# Altium schematic sheet Input_Stage.SchDoc
size A4; SheetNumber: 2; SheetTotal: 6
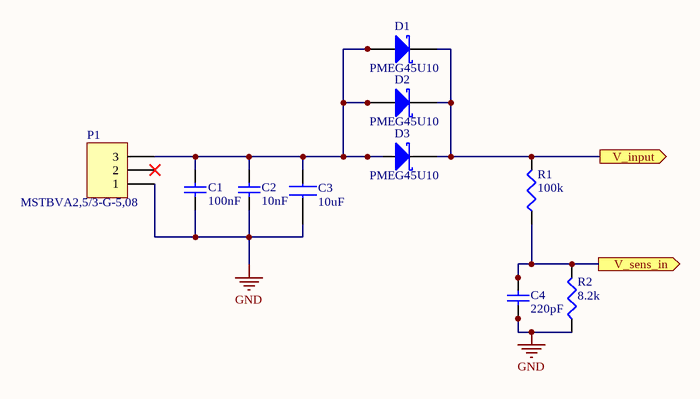
[diagram p0: Input_Stage.SchDoc]

## Parts
C1  value 100nF  [CAPC3216X180N]  (hidden comment: 10nF)
C2  value 10nF  [CAPC3216X180N]  (hidden comment: 100µF)
C3  value 10uF  [CAPC3225X270N]  (hidden comment: GRM32EC72A106KE05K)
C4  220pF  [CAPC3216X180N]
D1  PMEG45U10  [PMEG45U10EPDZ]
D2  PMEG45U10  [PMEG45U10EPDZ]
D3  PMEG45U10  [PMEG45U10EPDZ]
P1  MSTBVA2,5/3-G-5,08  [HDR1X3]
R1  value 100k  [RESC3216X75N]  (hidden comment: 100KΩ)
R2  value 8.2k  [RESC3216X75N]  (hidden comment: 8.2KΩ)

## Ports
V_input (out), V_sens_in (out)

## Nets
GND: C1.1 C2.1 C3.1 C4.1 P1.1 R2.1
V_input: D1.3 D2.3 D3.3 R1.2 ; port V_input
V_sens_in: C4.2 R1.1 R2.2 ; port V_sens_in
NetC1_2: C1.2 C2.2 C3.2 D1.1 D1.2 D2.1 D2.2 D3.1 D3.2 P1.3

Not connected (* = marked no-connect by the designer): P1 2*

## Library data of the parts
C1 = CC1206KKX7R0BB104: Capacitor 100nF; Published: 8-Jun-2000; LatestRevisionDate: 17-Jul-2002; LatestRevisionNote: Re-released for DXP Platform.; PackageReference: RAD-0.3; Publisher: Altium Limited; PackageDescription: Radial Cap, Thru-Hole; 2 Leads; 0.3 in Pin Spacing; Supplier 1: Farnell
C2 = C1206C103K1RACTU: Capacitor 10nF; Published: 8-Jun-2000; LatestRevisionDate: 17-Jul-2002; LatestRevisionNote: Re-released for DXP Platform.; PackageReference: RAD-0.3; Publisher: Altium Limited; PackageDescription: Radial Cap, Thru-Hole; 2 Leads; 0.3 in Pin Spacing; Supplier 1: Mouser
C3 = GRM32EC72A106KE05K: Ceramic capacitor 10uF; Manufacturer_Name: Murata Electronics; Height: 2.7mm; Manufacturer_Part_Number: GRM32EC72A106KE05K; Mouser Part Number: 81-GRM32EC72A106KE5K; Mouser Price/Stock: https://www.mouser.co.uk/ProductDetail/Murata-Electronics/GRM32EC72A106KE05K?qs=rrS6PyfT74e65RehvwNPbw%3D%3D; Arrow Part Number: GRM32EC72A106KE05K; Arrow Price/Stock: https://www.arrow.com/en/products/grm32ec72a106ke05k/murata-manufacturing?region=nac
C4 = VJ1206A221JXBCW1BC: Capacitor 220pF; Published: 8-Jun-2000; LatestRevisionDate: 17-Jul-2002; LatestRevisionNote: Re-released for DXP Platform.; PackageReference: RAD-0.3; Publisher: Altium Limited; PackageDescription: Radial Cap, Thru-Hole; 2 Leads; 0.3 in Pin Spacing; Supplier 1: Mouser; Value: 220pF
D1-D3 = PMEG45U10EPDZ: Schottky Diode; Manufacturer_Name: Nexperia; Datasheet Link: https://assets.nexperia.com/documents/data-sheet/PMEG45U10EPD.pdf; Height: 0.82mm; Manufacturer_Part_Number: PMEG45U10EPDZ; Mouser Part Number: 771-PMEG45U10EPDZ; Mouser Price/Stock: https://www.mouser.co.uk/ProductDetail/Nexperia/PMEG45U10EPDZ?qs=M%2FOdCRO8QQ0v3Dd16sTKSg%3D%3D; Arrow Part Number: PMEG45U10EPDZ; Arrow Price/Stock: https://www.arrow.com/en/products/pmeg45u10epdz/nexperia
P1 = MSTBVA2,5/3-G-5,08: Header, 3-Pin; LatestRevisionDate: 17-Jul-2002; LatestRevisionNote: Re-released for DXP Platform.; Publisher: Altium Limited
R1 = MCWR12X1003FTL: Resistor 100k; Published: 8-Jun-2000; LatestRevisionDate: 29-May-2009; LatestRevisionNote: IPC-7351 Footprint Added.; PackageReference: J1-0603; Publisher: Altium Limited; PackageDescription: Chip Resistor; Supplier 1: Farnell
R2 = CRGCQ1206F8K2: Resistor 8.2k; Published: 8-Jun-2000; LatestRevisionDate: 29-May-2009; LatestRevisionNote: IPC-7351 Footprint Added.; PackageReference: J1-0603; Publisher: Altium Limited; PackageDescription: Chip Resistor; Supplier 1: Mouser